# EAGLE design esp32 (EAGLE 9.6.2)
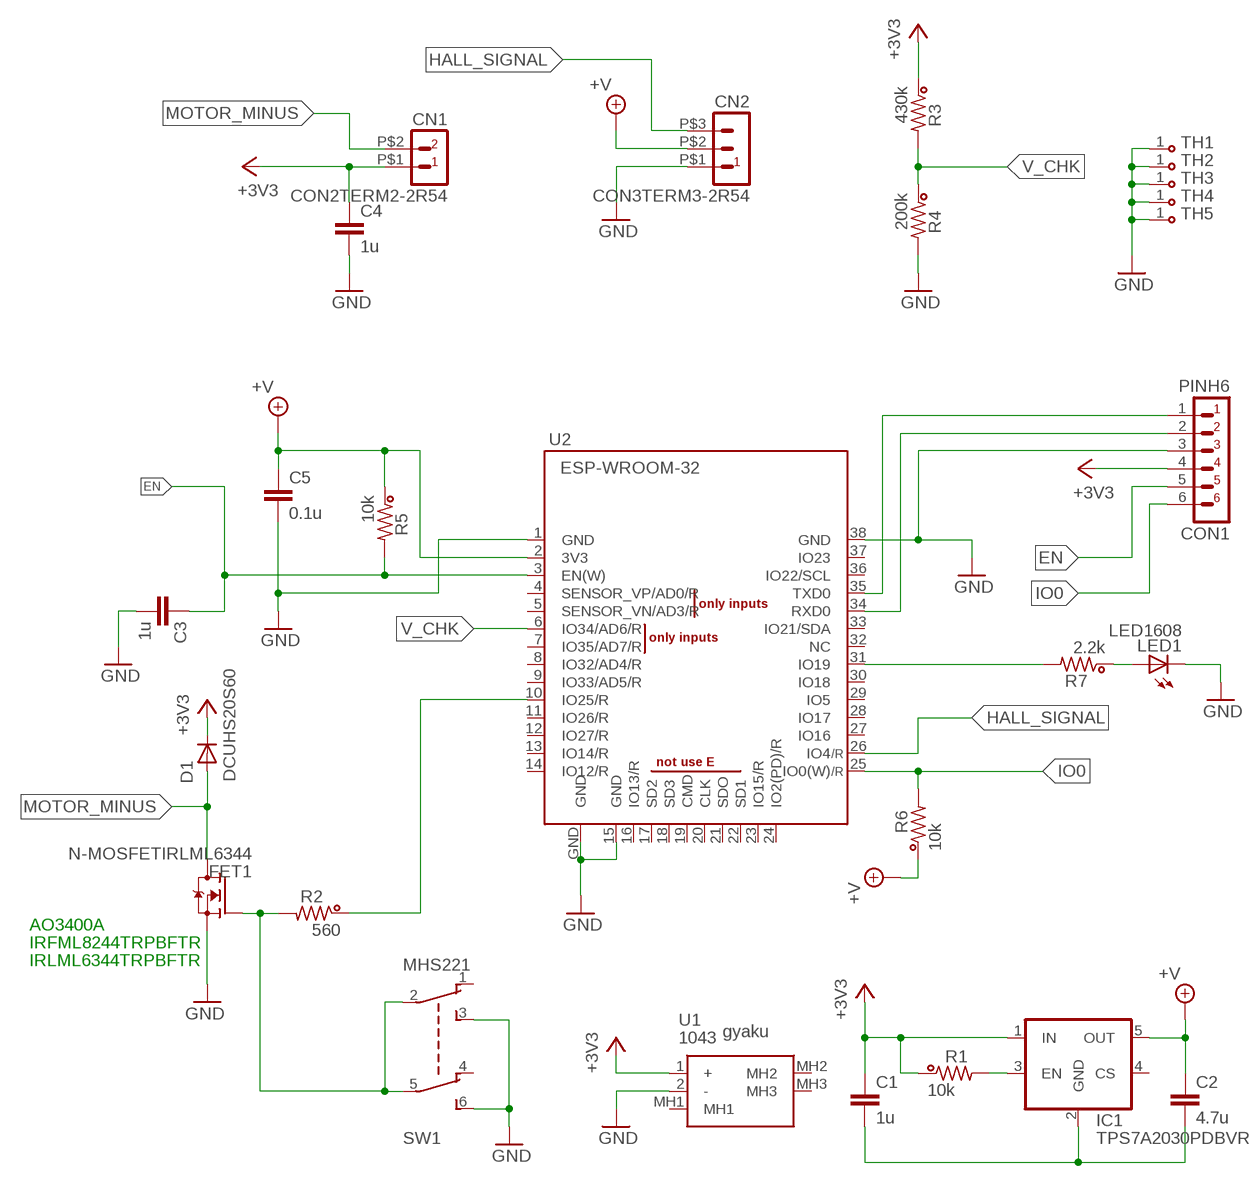
[diagram p0: schematic, sheet 1]

## Parts
C1  1u  C-CC2015  [2015]
C2  4.7u  C-CC2015  [2015]
C3  1u  C-CC2015  [2015]
C4  1u  C-CC2015  [2015]
C5  0.1u  C-CC2015  [2015]
CN1  CON2TERM2-2R54  [TERM2-2R54]
CN2  CON3TERM3-2R54  [TERM3-2R54]
CON1  PINH6  [PINH6]
D1  DCUHS20S60  [US2H]
FET1  N-MOSFETIRLML6344  [SOT23-3]
IC1  TPS7A2030PDBVR  TLV703  [SOT23-5]
LED1  LED1608  [LED1608]
R1  10k  R-CC1608  [1608]
R2  560  R-CC1608  [1608]
R3  430k  R-CC1608  [1608]
R4  200k  R-CC1608  [1608]
R5  10k  R-CC1608  [1608]
R6  10k  R-CC1608  [1608]
R7  2.2k  R-CC1608  [1608]
SW1  MHS221  [MHS221]
TH1  THTH220  [TH220]
TH2  THTH220  [TH220]
TH3  THTH220  [TH220]
TH4  THTH220  [TH220]
TH5  THGG  [TH6-GG]
U1  1043  [1043]
U2  ESP-WROOM-32  [ESP-WROOM-32]

## Nets
+3V3: C1.1 C4.1 CN1.P$1 CON1.4 D1.C IC1.1(IN) R1.1 R3.1 U1.1(+)
+V: C2.1 C5.1 CN2.P$2 IC1.5(OUT) R5.1 R6.1 U2.2(3V3)
EN: C3.1 CON1.5 R5.2 U2.3(EN(W))
GND: C1.2 C2.2 C3.2 C4.2 C5.2 CN2.P$1 CON1.3 FET1.2(S) IC1.2(GND) LED1.K(C) R4.2 SW1.3 SW1.6 TH1.1 TH2.1 TH3.1 TH4.1 TH5.1 U1.2(-) U2.1(GND) U2.15(GND) U2.38(GND) U2.GND
HALL_SIGNAL: CN2.P$3 U2.26(IO4)
IO0: CON1.6 R6.2 U2.25(IO0(W))
MOTOR_MINUS: CN1.P$2 D1.A FET1.3(D)
N$1: IC1.3(EN) R1.2
N$4: R7.2 U2.31(IO19)
N$5: R2.1 U2.10(IO25/R)
N$6: FET1.1(G) R2.2 SW1.2 SW1.5
N$16: LED1.A R7.1
V_CHK: R3.2 R4.1 U2.6(IO34/AD6/R)
WRX: CON1.2 U2.34(RXD0)
WTX: CON1.1 U2.35(TXD0)
Unconnected: IC1.4(CS) SW1.1 SW1.4 U1.MH1 U1.MH2 U1.MH3 U2.4(SENSOR_VP/AD0/R) U2.5(SENSOR_VN/AD3/R) U2.7(IO35/AD7/R) U2.8(IO32/AD4/R) U2.9(IO33/AD5/R) U2.11(IO26/R) U2.12(IO27/R) U2.13(IO14/R) U2.14(IO12/R) U2.16(IO13/R) U2.17(SD2) U2.18(SD3) U2.19(CMD) U2.20(CLK) U2.21(SDO) U2.22(SD1) U2.23(IO15/R) U2.24(IO2(PD)/R) U2.27(IO16) U2.28(IO17) U2.29(IO5) U2.30(IO18) U2.32(NC) U2.33(IO21/SDA) U2.36(IO22/SCL) U2.37(IO23)

## Notes on the sheet
- AO3400A
- IRFML8244TRPBFTR
- IRLML6344TRPBFTR
- gyaku

## Library data of the parts
C1-C5 = dac:C-CC
CN1 = dac:CON2
CN2 = dac:CON3
CON1 = dac:PINH6
D1 = dac:D
FET1 = dac:N-MOSFET
IC1 = dac:TLV703
LED1 = dac:LED: LED rectangle, 5.7 x 3.2 mm
R1-R7 = dac:R-CC
SW1 = dac:MHS221
TH1-TH5 = dac:TH
U1 = SamacSys_Parts:1043: KEYSTONE - 1043 - BATTERY HOLDER, 18650, TH Source: Datasheet <http://www.keyelco.com/product-pdf.cfm?p=919>; DESCRIPTION: KEYSTONE - 1043 - BATTERY HOLDER, 18650, TH; HEIGHT: 14.86mm; MANUFACTURER_NAME: Keystone Electronics; MANUFACTURER_PART_NUMBER: 1043; MOUSER_PART_NUMBER: 534-1043; MOUSER_PRICE-STOCK: https://www.mouser.co.uk/ProductDetail/Keystone-Electronics/1043?qs=%2F7TOpeL5Mz6j%2FnxeOA1rsg%3D%3D
U2 = esp32:ESP-WROOM-32

## Net classes
1 wide: width 1.016 mm, clearance 1.016 mm

## Board
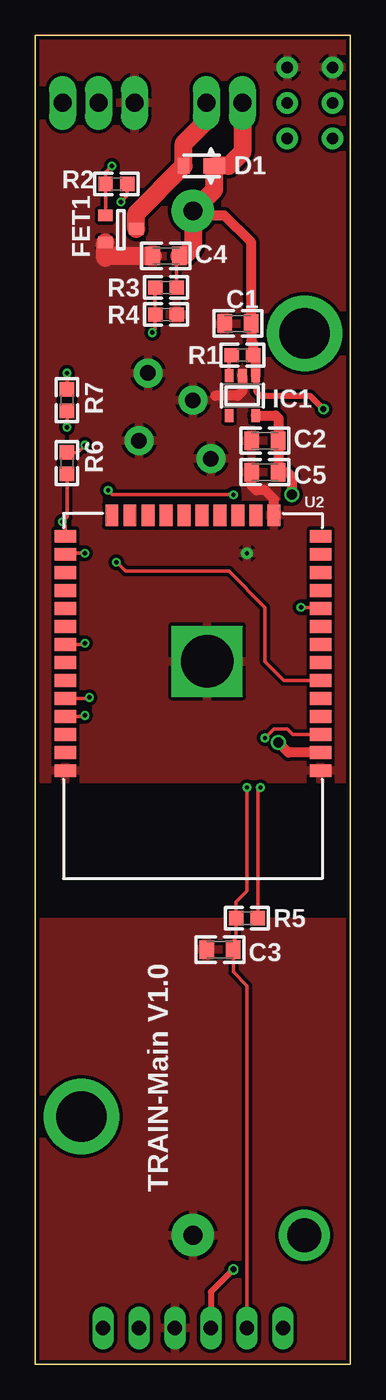
[diagram p1: board, top side]
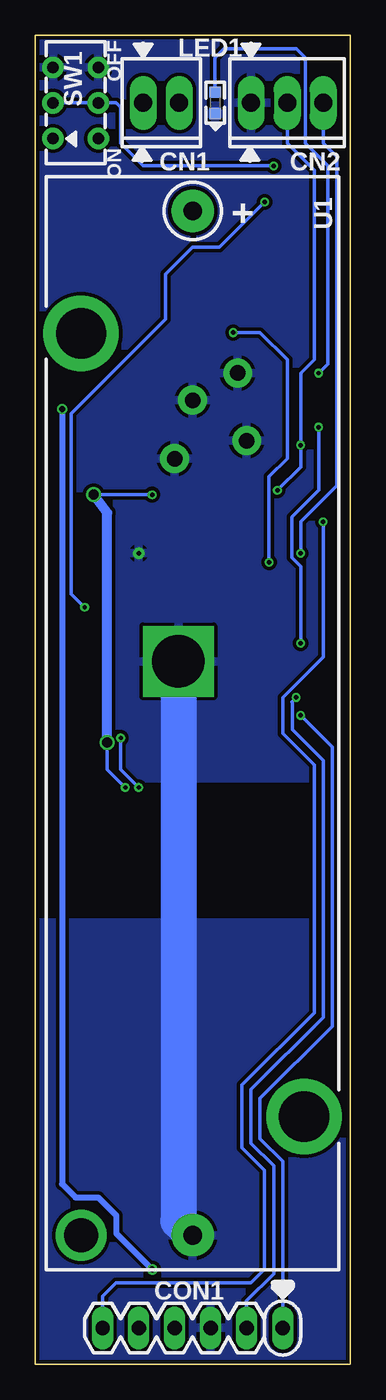
[diagram p2: board, bottom side, seen from below]

Size 22.2 x 93.65 mm. Coordinates in mm from the lower left corner, seen from the top.
Outline: 0,0 22.2,0 22.2,93.65 0,93.65 0,0
Copper layers (1*16): Top 0.035mm / dielectric 1.5mm / Bottom 0.035mm
Design rules "SeeedStudio_2layer_DRU_no_angle_20140221": minimum track width 6mil, minimum drill 12mil, track to track 6mil, track to pad 6mil, pad to pad 6mil, via to via 6mil, smd to smd 0mil, copper to edge 10mil, drill to drill 10mil, minimum pad ring 10mil, minimum via ring 6mil, stop-mask expansion 2mil, vias tented up to drill 100mil, thermal gap 10mil

### Footprints (pad centres in the part's own frame; a part is rotated, then mirrored left to right if it is on the bottom)
2015 = smd 1.016 x 1.3: 1 -0.94,0; 2 0.94,0
TERM2-2R54 = drill 1.27 long: P$1 2.54,0; P$2 0,0
TERM3-2R54 = drill 1.27 long: P$1 2.54,0; P$2 0,0; P$3 -2.54,0
PINH6 = drill 1.016 long: 1 -6.35,0; 2 -3.81,0; 3 -1.27,0; 4 1.27,0; 5 3.81,0; 6 6.35,0
US2H = smd 0.8 x 1.1: A 0.65,0 | smd 1.5 x 1.1: C -1.504,0
SOT23-3 = smd 0.8 x 1: 1 -0.95,-1.1; 2 0.95,-1.1; 3 0,1.08
SOT23-5 = smd 0.6 x 0.9: 1 -0.95,-1.417; 2 0,-1.417; 3 0.95,-1.417; 4 0.95,1.402; 5 -0.95,1.402
LED1608 = smd 0.8 x 0.8: A -0.75,0; K 0.75,0
1608 = smd 1.016 x 1: 1 -0.762,0; 2 0.762,0
MHS221 = drill 0.82 pad 1.5: 1 -2.5,1.6; 2 0,1.6; 3 2.5,1.6; 4 -2.5,-1.6; 5 0,-1.6; 6 2.5,-1.6
TH220 = drill 1.092 pad 2.032: 1 0,0
TH6-GG = drill 0.31: 1 0,0
1043 = drill 1.32 pad 3: 1 -36.83,0; 2 35.37,0 | drill 3.55 pad 5.325: MH1 -28.19,-7.87; MH3 27.01,7.87 | drill 2.39 pad 3.585: MH2 35.37,-7.87
ESP-WROOM-32 = smd 0.9 x 1.5: 1 7.7,9; 2 6.43,9; 3 5.16,9; 4 3.89,9; 5 2.62,9; 6 1.35,9; 7 0.08,9; 8 -1.19,9; 9 -2.46,9; 10 -3.73,9; 11 -5,9; 12 -6.27,9; 13 -7.54,9; 14 -8.81,9; 25 -8.81,-9; 26 -7.54,-9; 27 -6.27,-9; 28 -5,-9; 29 -3.73,-9; 30 -2.46,-9; 31 -1.19,-9; 32 0.08,-9; 33 1.35,-9; 34 2.62,-9; 35 3.89,-9; 36 5.16,-9; 37 6.43,-9; 38 7.7,-9 | smd 1.5 x 0.9: 15 -10.3,5.715; 16 -10.3,4.445; 17 -10.3,3.175; 18 -10.3,1.905; 19 -10.3,0.635; 20 -10.3,-0.635; 21 -10.3,-1.905; 22 -10.3,-3.175; 23 -10.3,-4.445; 24 -10.3,-5.715 | drill 3.7 pad 5 square: GND 0,1

### Placement (x,y rotation side)
C1  14.29,73.34 180 top
C2  16.19,65.09 180 top
C3  13.02,29.21 180 top
C4  9.21,78.11 180 top
C5  16.19,62.87 180 top
CN1  12.06,88.9 180 bottom
CN2  4.45,88.9 180 bottom
CON1  11.11,2.54 180 bottom
D1  11.11,84.45 180 top
FET1  6.03,80.01 270 top
IC1  14.61,68.26 180 top
LED1  9.53,88.9 270 bottom
R1  14.61,71.12 180 top
R2  5.71,83.19 180 top
R3  9.21,75.88 180 top
R4  9.21,73.98 0 top
R5  14.92,31.43 180 top
R6  2.22,63.5 270 top
R7  2.22,67.94 270 top
SW1  19.37,88.9 90 bottom
TH1  11.11,67.94 0 top
TH2  7.94,69.85 0 top
TH3  7.3,65.09 0 top
TH4  12.38,63.82 0 top
TH5  14.92,57.15 0 top
U1  11.11,44.45 270 bottom
U2  11.11,49.53 270 top

### Tracks (layer width: path | path; a pad name or v marks a point on that pad's centre or on a via)
+3V3  (via drill 0.43)
  Top 0.254: R3.1 9.97,77.6 10.48,78.11
  Top 0.406: IC1.1 15.56,68.58 15.88,68.26 19.37,68.26 v20.32,67.31 | v13.97,6.67 12.38,5.08 CON1.4
  Top 0.7: IC1.1 15.55,70.93 R1.1 15.37,71.94 15.23,72.08 C1.1 15.23,79.07 13.34,80.96 11.43,80.96 U1.1
  Top 1.27: CN1.P$1 14.61,85.41 13.65,84.45 D1.C 12.62,82.78 U1.1 11.11,78.74 10.48,78.11 C4.1
  Bottom 0.406: v13.97,6.67 16.51,9.21 16.51,10.48 17.78,11.75 19.37,11.75 20.32,12.7 v20.32,67.31
+V  (via drill 0.31, 0.7)
  Top 0.254: v3.49,64.77 2.98,64.26 R6.1 | v13.97,61.28 5.4,61.28 5.13,61.55 v5.13,61.59 | R5.1 15.68,40.45 v15.88,40.64
  Top 0.61: 17.14,65.1 C2.1
  Top 0.7: U2.2 17.86,43.1 v17.14,43.81 | IC1.5 16.96,66.86 17.14,66.67 17.14,65.1 | C2.1 C5.1 17.78,62.87 18.1,62.55 v18.1,61.28
  Bottom 0.254: CN2.P$2 4.45,86.04 2.54,84.14 2.54,70.8 3.49,69.85 v3.49,64.77 3.49,63.23 v5.13,61.59 | v18.1,61.28 v13.97,61.28 | v15.88,40.64 17.14,41.91 v17.14,43.81
  Bottom 0.7: v17.14,43.81 17.14,60.01 v18.1,61.28
EN  (via drill 0.31)
  Top 0.254: v14.92,40.64 14.92,33.34 14.16,32.58 R5.2 14.16,30.04 13.96,29.83 C3.1 13.96,27.64 14.92,26.67 CON1.5 | U2.3 18.18,44.37 17.78,44.77 16.83,44.77 v16.19,44.13
  Bottom 0.254: v16.19,44.13 16.19,41.91 v14.92,40.64
GND
  Top 0.7: U2.15 16.83,60.96 16.19,61.59 15.56,61.59 15.24,61.91 15.24,62.85 C5.2 | IC1.2 14.61,68.58 14.29,68.26 12.7,68.26
  Top 1.27: FET1.2 4.93,77.96 5.08,78.11 C4.2
  Bottom 2.54: U2.GND 12.11,10.08 U1.2
  pour Top (isolate 0.25): -0.32,0 22.54,0 22.54,93.98 -0.32,93.98
  pour Bottom (isolate 0.25): -0.32,0 25.08,0 25.08,95.25 -0.32,95.25
HALL_SIGNAL  (via drill 0.31)
  Top 0.254: v3.49,57.15 2.19,57.15 U2.26
  Bottom 0.254: CN2.P$3 1.91,86.04 0.95,85.09 0.95,61.91 3.49,59.37 v3.49,57.15
IO0  (via drill 0.31)
  Top 0.254: U2.25 2.11,59.16 v1.91,59.37 2.22,59.69 R6.2
  Bottom 0.254: CON1.6 17.46,4.76 16.51,5.71 6.99,5.71 6.03,6.67 6.03,13.65 7.62,15.24 7.62,19.68 2.54,24.77 2.54,42.23 4.76,44.45 4.76,46.99 1.91,49.85 v1.91,59.37
MOTOR_MINUS
  Top 1.27: CN1.P$2 12.06,87.63 10.46,86.03 D1.A 7.11,81.11 FET1.3
N$1
  Top 0.254: IC1.3 13.65,70.93 R1.2
N$4  (via drill 0.31)
  Top 0.254: U2.31 3.41,50.72 v3.49,50.8 | R7.2 v2.22,66.04
  Bottom 0.254: v3.49,50.8 3.49,56.2 4.13,56.83 4.13,59.69 2.22,61.59 v2.22,66.04
N$5  (via drill 0.31)
  Top 0.254: v18.73,53.34 20.03,53.34 U2.10 | R2.1 6.48,82.36 v6.03,81.92
  Bottom 0.254: v18.73,53.34 19.68,54.29 19.68,66.99 13.02,73.66 13.02,76.83 11.11,78.74 9.21,78.74 v6.03,81.92
N$6  (via drill 0.31)
  Top 0.254: FET1.1 4.95,80.98 R2.2 4.95,84.01 v5.4,84.45
  Bottom 0.254: SW1.2 SW1.5 16.51,88.9 16.19,88.58 16.19,86.04 14.61,84.45 v5.4,84.45
N$16  (via drill 0.31)
  Top 0.254: R7.1 v2.22,69.85
  Bottom 0.254: v2.22,69.85 1.59,70.48 1.59,84.45 3.17,86.04 3.17,92.08 3.81,92.71 8.89,92.71 9.53,92.08 LED1.A
V_CHK  (via drill 0.31)
  Top 0.254: U2.6 17.54,48.18 16.19,49.53 16.19,53.34 13.65,55.88 6.35,55.88 v5.71,56.52 | v8.26,72.71 8.45,72.9 R4.1 R3.2
  Bottom 0.254: v5.71,56.52 5.71,62.55 4.45,63.82 4.45,70.8 6.35,72.71 v8.26,72.71
WRX  (via drill 0.31)
  Top 0.254: v3.81,46.99 3.73,46.91 U2.34
  Bottom 0.254: CON1.2 7.3,4.45 5.4,6.35 5.4,13.97 6.99,15.56 6.99,19.37 1.91,24.45 1.91,42.55 4.08,44.72 4.08,46.62 4.13,46.67 v3.81,46.99
WTX  (via drill 0.31)
  Top 0.254: v3.49,45.72 3.41,45.64 U2.35
  Bottom 0.254: CON1.1 4.76,14.29 6.35,15.88 6.35,18.73 1.27,23.81 1.27,43.5 v3.49,45.72

### Text on the board
tPlace: TRAIN-Main V1.0
bPlace: OFF | ON